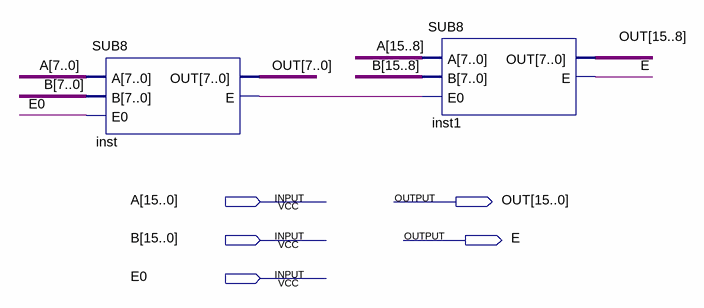
[diagram p0: schematic sheet]
// Quartus schematic SUB16.bdf as structural Verilog: 2 symbols, 5 pins
module SUB16 (
  input  [15:0] A,
  input  [15:0] B,
  input  E0,
  output [15:0] OUT,
  output E
);

  wire inst_e;

  SUB8 inst (.A(A[7:0]), .B(B[7:0]), .E0(E0), .OUT(OUT[7:0]), .E(inst_e));
  SUB8 inst1 (.A(A[15:8]), .B(B[15:8]), .E0(inst_e), .OUT(OUT[15:8]), .E(E));
endmodule
